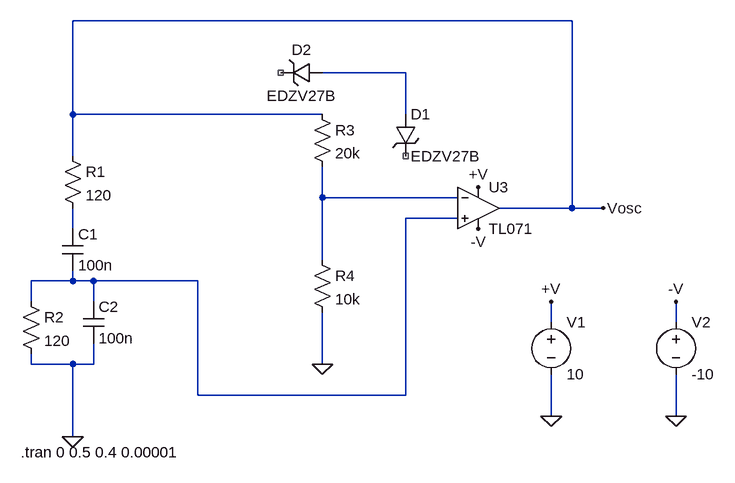
[diagram p0: schematic Osc.asc]
Osc.asc, the LTspice schematic file:
Version 4
SHEET 1 1036 680
WIRE 560 -144 -208 -144
WIRE 304 -64 176 -64
WIRE -208 0 -208 -144
WIRE 176 0 -208 0
WIRE 304 0 304 -64
WIRE -208 64 -208 0
WIRE 176 128 176 80
WIRE 384 128 176 128
WIRE 560 144 560 -144
WIRE 560 144 448 144
WIRE 608 144 560 144
WIRE 384 160 304 160
WIRE -208 176 -208 144
WIRE 176 224 176 128
WIRE -208 256 -208 240
WIRE -208 256 -272 256
WIRE -176 256 -208 256
WIRE -16 256 -176 256
WIRE -272 288 -272 256
WIRE -176 288 -176 256
WIRE 528 320 528 288
WIRE 720 320 720 288
WIRE -272 384 -272 368
WIRE -208 384 -272 384
WIRE -176 384 -176 352
WIRE -176 384 -208 384
WIRE 176 384 176 304
WIRE -16 432 -16 256
WIRE 304 432 304 160
WIRE 304 432 -16 432
WIRE 528 464 528 400
WIRE 720 464 720 400
WIRE -208 496 -208 384
FLAG -208 496 0
FLAG 176 384 0
FLAG 608 144 Vosc
FLAG 528 464 0
FLAG 720 464 0
FLAG 720 288 -V
FLAG 528 288 +V
FLAG 416 176 -V
FLAG 416 112 +V
SYMBOL cap -224 176 R0
SYMATTR InstName C1
SYMATTR Value 100n
SYMBOL cap -192 288 R0
SYMATTR InstName C2
SYMATTR Value 100n
SYMBOL res -224 48 R0
SYMATTR InstName R1
SYMATTR Value 120
SYMBOL res -288 272 R0
SYMATTR InstName R2
SYMATTR Value 120
SYMBOL res 160 -16 R0
SYMATTR InstName R3
SYMATTR Value 20k
SYMBOL res 160 208 R0
SYMATTR InstName R4
SYMATTR Value 10k
SYMBOL zener 288 0 R0
SYMATTR InstName D1
SYMATTR Value EDZV27B
SYMBOL zener 176 -80 R90
WINDOW 0 -4 32 VBottom 2
WINDOW 3 36 32 VTop 2
SYMATTR InstName D2
SYMATTR Value EDZV27B
SYMBOL voltage 528 304 R0
WINDOW 123 0 0 Left 2
WINDOW 39 0 0 Left 2
SYMATTR InstName V1
SYMATTR Value 10
SYMBOL voltage 720 304 R0
WINDOW 123 0 0 Left 2
WINDOW 39 0 0 Left 2
SYMATTR InstName V2
SYMATTR Value -10
SYMBOL Opamps\\TL071 416 80 R0
SYMATTR InstName U3
TEXT -288 520 Left 2 !.tran 0 0.5 0.4 0.00001

The netlist it stands for:
* Osc.asc
C1 N004 N003 100n
C2 N003 0 100n
R1 Vosc N004 120
R2 N003 0 120
R3 Vosc N002 20k
R4 N002 0 10k
D1 N001 NC_01 EDZV27B
D2 N001 NC_02 EDZV27B
V1 +V 0 10
V2 -V 0 -10
XU3 N003 N002 +V -V Vosc TL071  ; pins In+ In- V+ V- OUT
.model D D
.lib standard.dio
.tran 0 0.5 0.4 0.00001
.backanno
.end